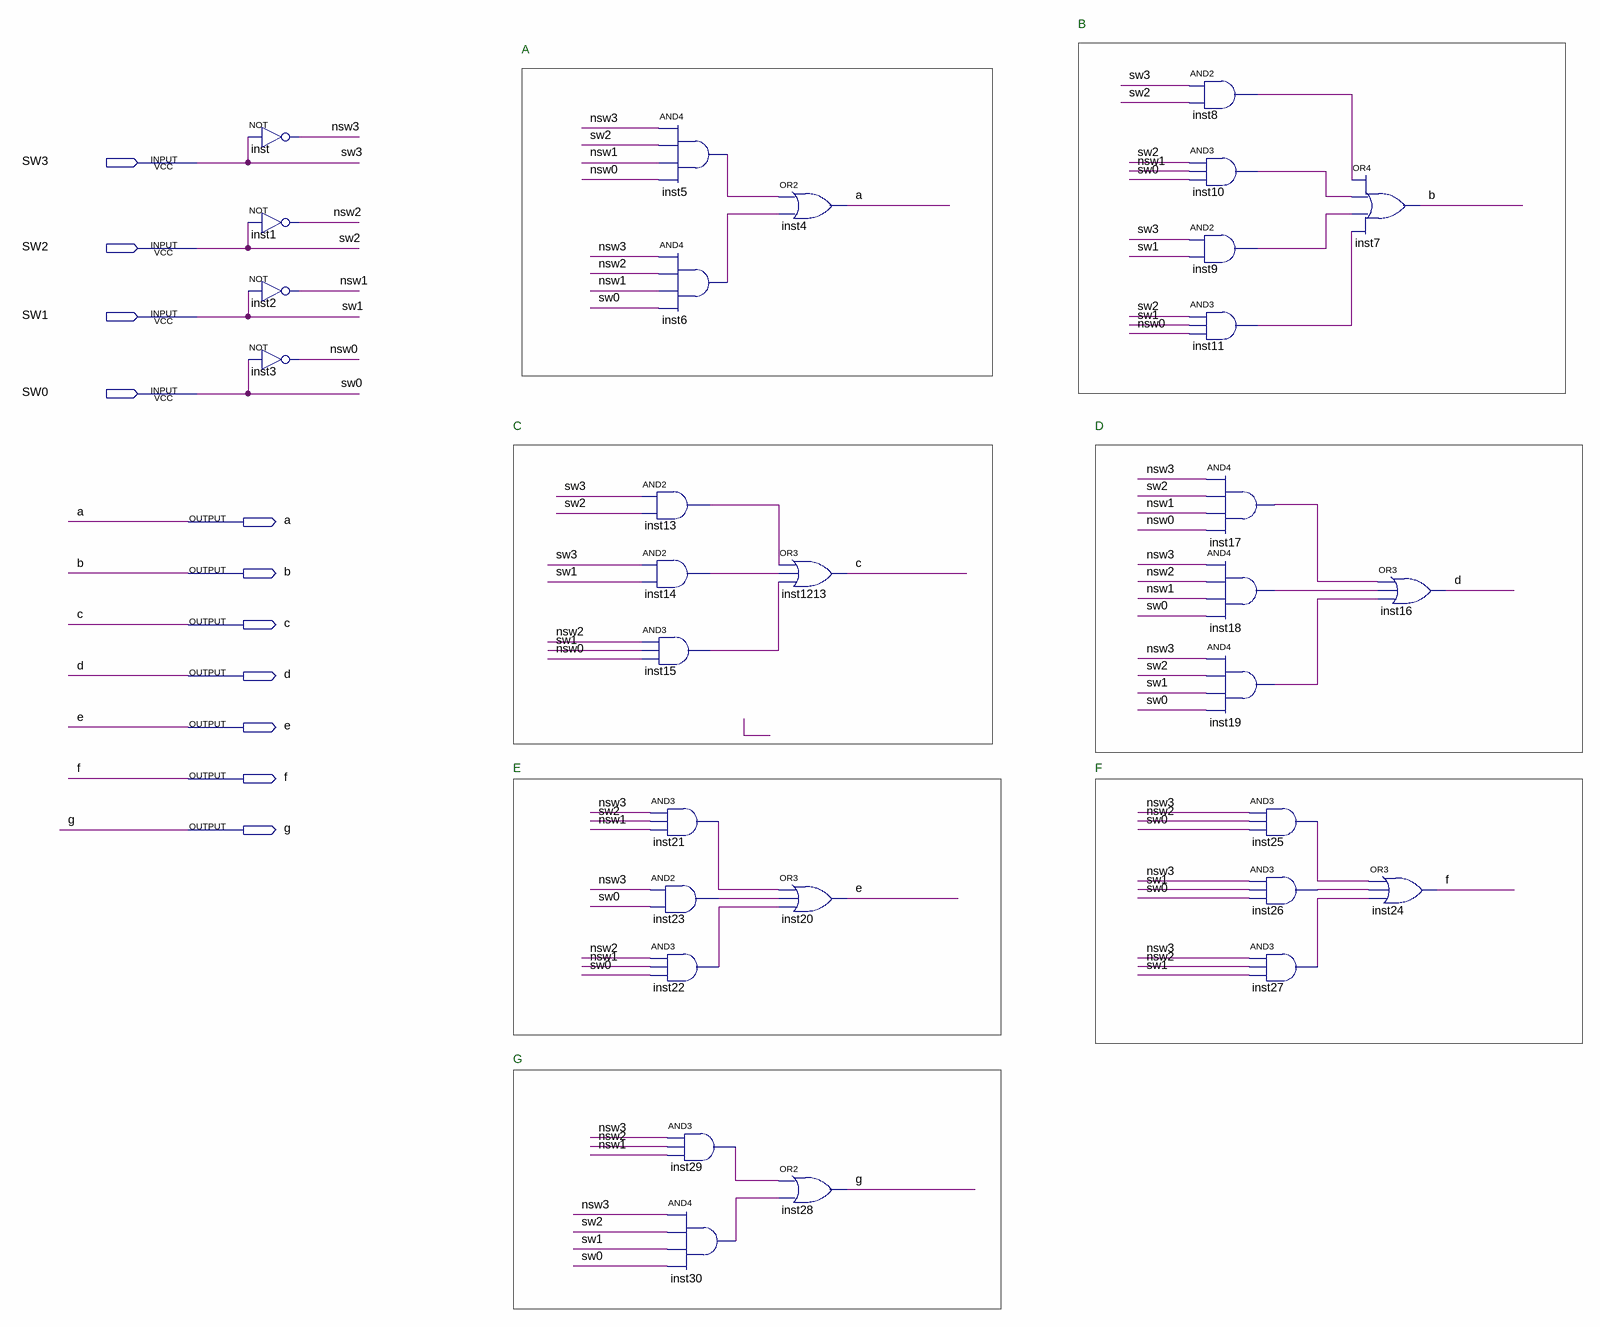
[diagram p0: schematic sheet]
// Quartus schematic lab1.bdf as structural Verilog: 31 symbols, 11 pins
module lab1 (
  input  SW3,
  input  SW2,
  input  SW1,
  input  SW0,
  output a,
  output b,
  output c,
  output d,
  output e,
  output f,
  output g
);

  wire inst5_out, inst6_out, inst8_out, inst9_out, inst10_out, inst11_out, inst13_out, inst14_out,
       inst15_out, inst17_out, inst18_out, inst19_out, inst21_out, inst22_out, inst23_out, inst25_out,
       inst26_out, inst27_out, inst29_out, inst30_out, nsw0, nsw1, nsw2, nsw3;

  not inst (nsw3, SW3);
  not inst1 (nsw2, SW2);
  not inst2 (nsw1, SW1);
  not inst3 (nsw0, SW0);
  and inst5 (inst5_out, nsw3, SW2, nsw1, nsw0);
  and inst6 (inst6_out, nsw3, nsw2, nsw1, SW0);
  and inst13 (inst13_out, SW3, SW2);
  and inst14 (inst14_out, SW3, SW1);
  and inst15 (inst15_out, nsw2, SW1, nsw0);
  and inst21 (inst21_out, nsw3, SW2, nsw1);
  and inst23 (inst23_out, nsw3, SW0);
  and inst22 (inst22_out, nsw2, nsw1, SW0);
  and inst29 (inst29_out, nsw3, nsw2, nsw1);
  and inst30 (inst30_out, nsw3, SW2, SW1, SW0);
  or inst4 (a, inst5_out, inst6_out);
  or inst1213 (c, inst13_out, inst14_out, inst15_out);
  or inst20 (e, inst21_out, inst23_out, inst22_out);
  or inst28 (g, inst29_out, inst30_out);
  and inst8 (inst8_out, SW3, SW2);
  and inst10 (inst10_out, SW2, nsw1, SW0);
  and inst9 (inst9_out, SW3, SW1);
  and inst11 (inst11_out, SW2, SW1, nsw0);
  and inst17 (inst17_out, nsw3, SW2, nsw1, nsw0);
  and inst18 (inst18_out, nsw3, nsw2, nsw1, SW0);
  and inst19 (inst19_out, nsw3, SW2, SW1, SW0);
  and inst25 (inst25_out, nsw3, nsw2, SW0);
  and inst26 (inst26_out, nsw3, SW1, SW0);
  and inst27 (inst27_out, nsw3, nsw2, SW1);
  or inst7 (b, inst8_out, inst10_out, inst9_out, inst11_out);
  or inst16 (d, inst17_out, inst18_out, inst19_out);
  or inst24 (f, inst25_out, inst26_out, inst27_out);

  // Notes on the sheet:
  //   B
  //   A
  //   C
  //   D
  //   E
  //   F
  //   G
endmodule
